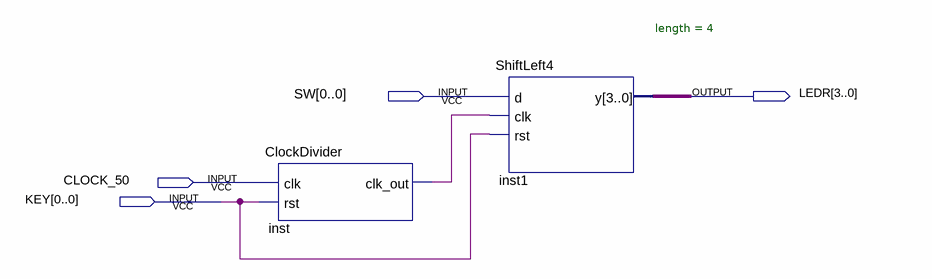
[diagram p0: schematic sheet]
// Quartus schematic Block_ShiftLeft4.bdf as structural Verilog: 2 symbols, 4 pins
module Block_ShiftLeft4 (
  input  [0:0] SW,
  input  CLOCK_50,
  input  [0:0] KEY,
  output [3:0] LEDR
);

  wire inst_clk_out;

  ClockDivider inst (.clk(CLOCK_50), .rst(KEY[0]), .clk_out(inst_clk_out));
  ShiftLeft4 #(.length(4)) inst1 (.d(SW[0]), .clk(inst_clk_out), .rst(KEY[0]), .y(LEDR));
endmodule
